# EAGLE schematic BluetoothJsoknitPID (EAGLE 6.1)
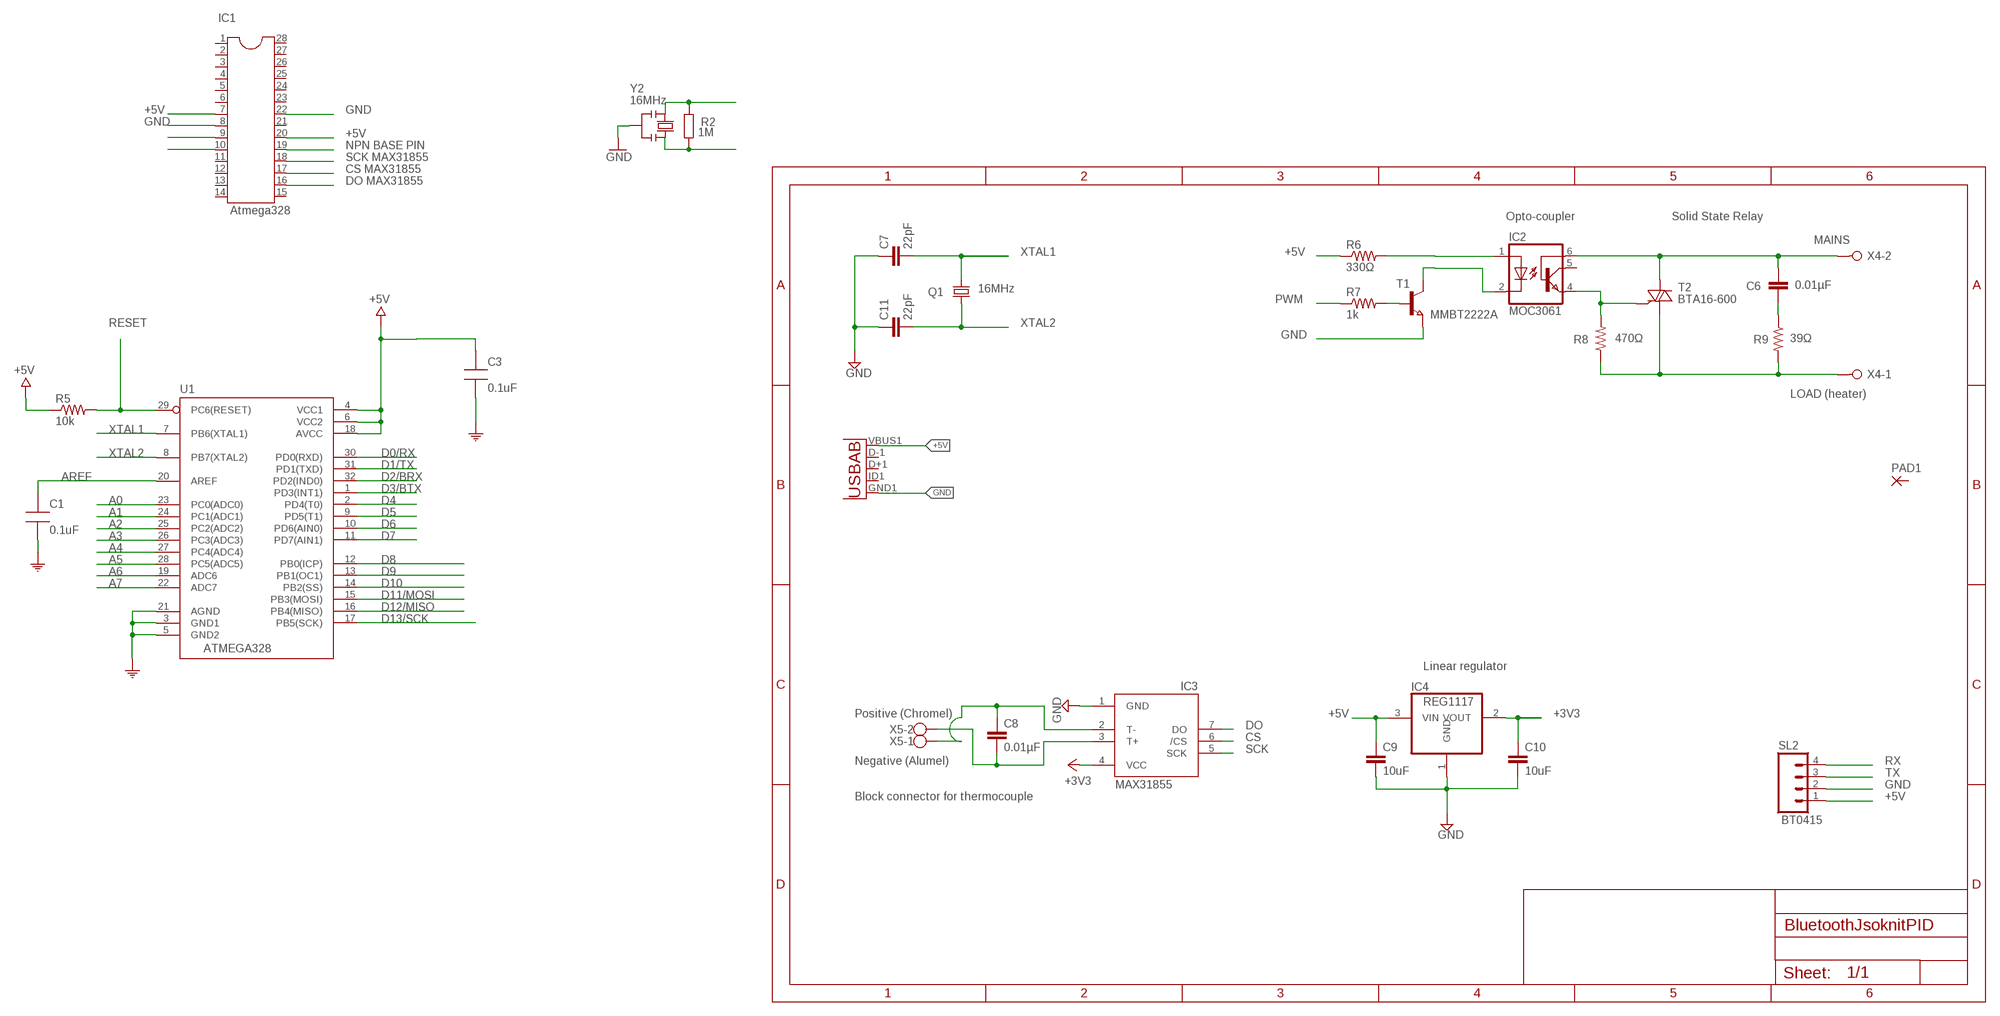
[diagram p0: schematic, sheet 1]

## Parts
C1  0.1uF  CAP0805-NP  [CAP0805-NP]
C3  0.1uF  CAP0805-NP  [CAP0805-NP]
C6  0.01µF  C-EU050-025X075  [C050-025X075]
C7  22pF  C-EUC0805  [C0805]
C8  0.01µF  C-EUC0805  [C0805]
C9  10uF  CAP1206  [1206]
C10  10uF  CAP1206  [1206]
C11  22pF  C-EUC0805  [C0805]
IC1  Atmega328  DIL28-3  [DIL28-3]
IC2  MOC3061  4N25SM  [DIL6-SMD]
IC3  MAX6675  [SO08]
IC4  REG1117  [SOT223]
PAD1  SMD2  [SMD1,27-2,54]
Q1  16MHz  CRYSTALHC49S  [HC49/S]
R2  1M  R-EU_R0603  [R0603-ROUND]
R5  10k  R-US_M0805  [M0805]
R6  330Ω  R-US_0207/10  [0207/10]
R7  1k  R-US_0207/10  [0207/10]
R8  470Ω  R-US_0207/10  [0207/10]
R9  39Ω  R-US_0207/10  [0207/10]
SL2  BT0415  M04  [04P]
T1  MMBT2222A  NPN-TRANSISTOR_SOT23  [SOT23]
T2  BTA16-600  BT138-V  [TO220BV]
U1  ATMEGA328  ATMEGA168-20AU  [QFP032]
U$4  USB-AB""  [USB-AB-MICRO-SMD_V02_BOSS]
X4  W237-02P  [W237-132]
X5  W237-102  [W237-102]
Y2  16MHz  RESONATORMU  [RESONATOR]

## Nets
+3V3: C10.1 IC3.4(VCC) IC4.2(VOUT)
+5V: C3.1 C9.1 IC1.7 IC1.20 IC4.3(VIN) R5.1 R6.1 SL2.1 U1.4(VCC1) U1.6(VCC2) U1.18(AVCC) U$4.VBUS1(VBUS)
A0: U1.23(PC0(ADC0))
A1: U1.24(PC1(ADC1))
A2: U1.25(PC2(ADC2))
A3: U1.26(PC3(ADC3))
A4: U1.27(PC4(ADC4))
A5: U1.28(PC5(ADC5))
A6: U1.19(ADC6)
A7: U1.22(ADC7)
AREF: C1.1 U1.20(AREF)
COM: C1.2 C3.2 U1.3(GND1) U1.5(GND2) U1.21(AGND)
CS: IC1.17 IC3.6(/CS)
D0/RX: U1.30(PD0(RXD))
D1/TX: U1.31(PD1(TXD))
D2/BRX: U1.32(PD2(IND0))
D3/BTX: U1.1(PD3(INT1))
D4: U1.2(PD4(T0))
D5: U1.9(PD5(T1))
D6: U1.10(PD6(AIN0))
D7: U1.11(PD7(AIN1))
D8: U1.12(PB0(ICP))
D9: U1.13(PB1(OC1))
D10: U1.14(PB2(SS))
D11/MOSI: U1.15(PB3(MOSI))
D12/MISO: U1.16(PB4(MISO))
D13/SCK: U1.17(PB5(SCK))
DO: IC1.16 IC3.7(DO)
GND [Power]: C7.1 C9.2 C10.2 C11.1 IC1.8 IC1.22 IC3.1(GND) IC4.1(GND) SL2.2 T1.2(E) U$4.GND1(GND) Y2.2
LOAD [Power]: R8.1 R9.2 T2.T1(A1) X4.1
MOC3061PIN4: IC2.4(EMI) R8.2 T2.G
MOC3061PIN6: C6.1 IC2.6(BAS) T2.T2(A2) X4.2
N$9: IC2.2(C) T1.3(C)
N$10: R7.2 T1.1(B)
N$11: IC2.1(A) R6.2
N$14: C6.2 R9.1
NPNBASEPIN: IC1.19 R7.1
RESET: R5.2 U1.29(PC6(RESET))
RX: SL2.4
SCK: IC1.18 IC3.5(SCK)
T+1: C8.2 IC3.3(T+) X5.2
T-1: C8.1 IC3.2(T-) X5.1
TX: SL2.3
XTAL1: C7.2 IC1.9 Q1.2 U1.7(PB6(XTAL1))
XTAL2: C11.2 IC1.10 Q1.1 U1.8(PB7(XTAL2))
XTAL3: R2.2 Y2.1
XTAL4: R2.1 Y2.3
Unconnected: IC1.1 IC1.2 IC1.3 IC1.4 IC1.5 IC1.6 IC1.11 IC1.12 IC1.13 IC1.14 IC1.15 IC1.21 IC1.23 IC1.24 IC1.25 IC1.26 IC1.27 IC1.28 IC2.5(COL) PAD1.1(P) U$4.D+1(D+) U$4.D-1(D-) U$4.ID1(USBID)

## Notes on the sheet
- +5V | GND
- GND
- +5V
- NPN BASE PIN
- SCK MAX31855
- CS MAX31855
- DO MAX31855
- Opto-coupler | Solid State Relay
- MAINS
- XTAL1 | +5V
- PWM
- RESET | XTAL2
- GND
- LOAD (heater)
- XTAL1
- XTAL2
- Linear regulator
- Positive (Chromel) | +5V | +3V3
- DO
- CS
- SCK
- Negative (Alumel) | RX
- TX
- MAX31855 | GND
- Block connector for thermocouple | +5V

## Library data of the parts
C1 C3 = MySMD:CAP0805-NP
C6-C8 C11 = rcl:C-EU: CAPACITOR, European symbol
C9 C10 = SparkFun-Capacitors:CAP: Capacitor Standard 0603 ceramic capacitor, and 0.1" leaded capacitor.
IC1 = ic-package:DIL28: Dual In Line
IC2 = optocoupler:4N*?M: General Purpose 6-Pin Phototransistor Optocouplers Source: http://www.fairchildsemi.com/ds/4N/4N35-M.pdf; MF: FAIRCHILD SEMICONDUCTOR; MPN: 4N25SM; OC_FARNELL: 1021152; OC_NEWARK: 34C2020
IC3 = adafruit:MAX6675
IC4 = burr-brown:REG1117: 800mA and 1A Low Dropout (LDO) Positive Regulator 1.8V, 2.5V, 2.85V, 3.3V, 5V, and Adj; MPN: REG1117; OC_FARNELL: 1097566; OC_NEWARK: 14P6981
PAD1 = wirepad:SMD2: SMD PAD
Q1 = crystal:CRYSTAL: CRYSTAL
R2 = SmartPrj:R-EU_: RESISTOR, European symbol
R5-R9 = rcl:R-US_: RESISTOR, American symbol
SL2 = con-amp-quick:M04: AMP QUICK CONNECTOR; OC_FARNELL: unknown; OC_NEWARK: unknown
T1 = semicon-smd-ipc:NPN-TRANSISTOR_: NPN TRANSISTOR
T2 = triac:BT138: TRIAC Source: http://www.semiconductors.philips.com BT138_SERIES_2.pdf
U1 = MySMD:ATMEGA168-20AU
U$4 = Testing:USB-AB: This is a USB AB connector that is compatible with USB OTG. i.e. this connector can serve as a host or device
X4 = con-wago-508:W237-02P: WAGO SREW CLAMP; OC_FARNELL: unknown; OC_NEWARK: unknown
X5 = con-wago-500:W237-102: WAGO SCREW CLAMP; MPN: 237-102; OC_FARNELL: unknown; OC_NEWARK: 70K9898
Y2 = SmartPrj:RESONATOR

## Net classes
0 default: width 0.152 mm, clearance 0.152 mm
1 Power: width 1.016 mm, drill 0.61 mm, clearance 0.61 mm
2 gnd: width 0.203 mm, drill 0.559 mm, clearance 0.152 mm